# EAGLE design Mult-tl084 (EAGLE 9.2.0)
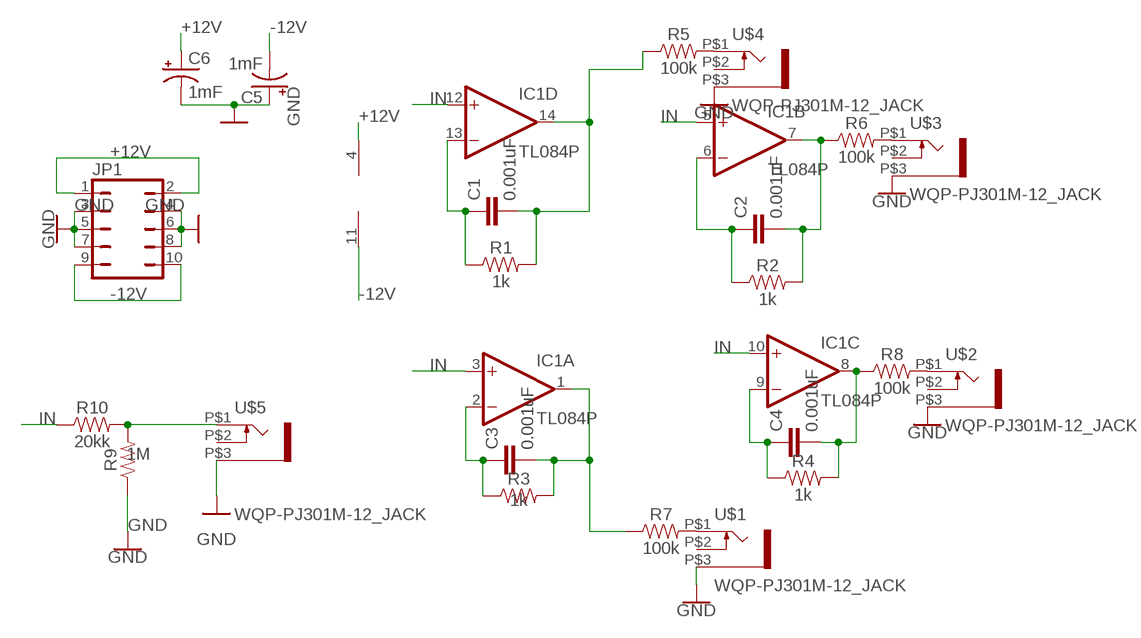
[diagram p0: schematic, sheet 1]

## Parts
C1  0.001uF  0.1UF-KIT-EZ-50V-20%  [CAP-PTH-SMALL-KIT]
C2  0.001uF  0.1UF-KIT-EZ-50V-20%  [CAP-PTH-SMALL-KIT]
C3  0.001uF  0.1UF-KIT-EZ-50V-20%  [CAP-PTH-SMALL-KIT]
C4  0.001uF  0.1UF-KIT-EZ-50V-20%  [CAP-PTH-SMALL-KIT]
C5  1mF  1000UF-RADIAL-5MM-25V-20%  [CPOL-RADIAL-5MM-10MM]
C6  1mF  1000UF-RADIAL-5MM-25V-20%  [CPOL-RADIAL-5MM-10MM]
IC1  TL084P  [DIL14]
JP1  JP5Q  [JP5Q]
R1  1k  1KOHM-HORIZ-1/4W-5%  [AXIAL-0.3]
R2  1k  1KOHM-HORIZ-1/4W-5%  [AXIAL-0.3]
R3  1k  1KOHM-HORIZ-1/4W-5%  [AXIAL-0.3]
R4  1k  1KOHM-HORIZ-1/4W-5%  [AXIAL-0.3]
R5  100k  1KOHM-HORIZ-1/4W-5%  [AXIAL-0.3]
R6  100k  1KOHM-HORIZ-1/4W-5%  [AXIAL-0.3]
R7  100k  1KOHM-HORIZ-1/4W-5%  [AXIAL-0.3]
R8  100k  1KOHM-HORIZ-1/4W-5%  [AXIAL-0.3]
R9  1M  1KOHM-HORIZ-1/4W-5%  [AXIAL-0.3]
R10  20kk  1KOHM-HORIZ-1/4W-5%  [AXIAL-0.3]
U$1  WQP-PJ301M-12_JACK  [WQP-PJ301M-12_JACK]
U$2  WQP-PJ301M-12_JACK  [WQP-PJ301M-12_JACK]
U$3  WQP-PJ301M-12_JACK  [WQP-PJ301M-12_JACK]
U$4  WQP-PJ301M-12_JACK  [WQP-PJ301M-12_JACK]
U$5  WQP-PJ301M-12_JACK  [WQP-PJ301M-12_JACK]

## Nets
+12V: C6.+ IC1.4(P:V+) JP1.1 JP1.2
-12V: C5.- IC1.11(P:V-) JP1.9 JP1.10
GND: C5.+ C6.- JP1.3 JP1.4 JP1.5 JP1.6 JP1.7 JP1.8 R9.P$1 U$1.P$3 U$2.P$3 U$3.P$3 U$4.P$3 U$5.P$3
IN: IC1.3(A:+IN) IC1.5(B:+IN) IC1.10(C:+IN) IC1.12(D:+IN) R10.P$1
N$1: C1.1 IC1.13(D:-IN) R1.P$1
N$2: C1.2 IC1.14(D:OUT) R1.P$2 R5.P$1
N$3: C2.1 IC1.6(B:-IN) R2.P$1
N$4: C2.2 IC1.7(B:OUT) R2.P$2 R6.P$1
N$5: C3.1 IC1.2(A:-IN) R3.P$1
N$6: C3.2 IC1.1(A:OUT) R3.P$2 R7.P$1
N$7: C4.1 IC1.9(C:-IN) R4.P$1
N$8: R8.P$2 U$2.P$1
N$9: C4.2 IC1.8(C:OUT) R4.P$2 R8.P$1
N$10: R6.P$2 U$3.P$1
N$11: R5.P$2 U$4.P$1
N$12: R7.P$2 U$1.P$1
N$13: R9.P$2 R10.P$2 U$5.P$1
Unconnected: U$1.P$2 U$2.P$2 U$3.P$2 U$4.P$2 U$5.P$2

## Library data of the parts
C1-C4 = SparkFun-Capacitors:0.1UF: 0.1µF ceramic capacitors A capacitor is a passive two-terminal electrical component used to store electrical energy temporarily in an electric field.; PROD_ID: CAP-08370; VALUE: 0.1uF
C5 C6 = SparkFun-Capacitors:1000UF: 1,000µF/1mF ceramic capacitors A capacitor is a passive two-terminal electrical component used to store electrical energy temporarily in an electric field. CAP-08070; PROD_ID: CAP-09538
IC1 = linear:TL084: OP AMP
JP1 = jumper:JP5Q: JUMPER
R1-R4 = SparkFun-Resistors:1KOHM: 1kΩ resistor A resistor is a passive two-terminal electrical component that implements electrical resistance as a circuit element. Resistors act to reduce current flow, and, at the same time, act to lower voltage levels within circuits. - Wikipedia; PROD_ID: RES-08380
R5-R10 = SparkFun-Resistors:1KOHM: 1kΩ resistor A resistor is a passive two-terminal electrical component that implements electrical resistance as a circuit element. Resistors act to reduce current flow, and, at the same time, act to lower voltage levels within circuits. - Wikipedia; PROD_ID: RES-08380; VALUE: 1k
U$1-U$5 = thonkiconn:WQP-PJ301M-12_JACK

## Board
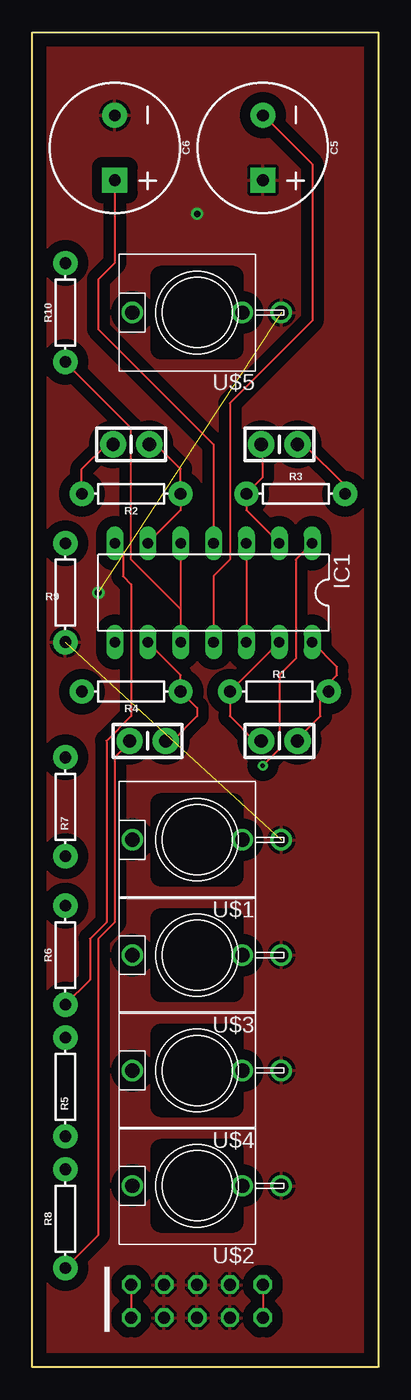
[diagram p1: board, top side]
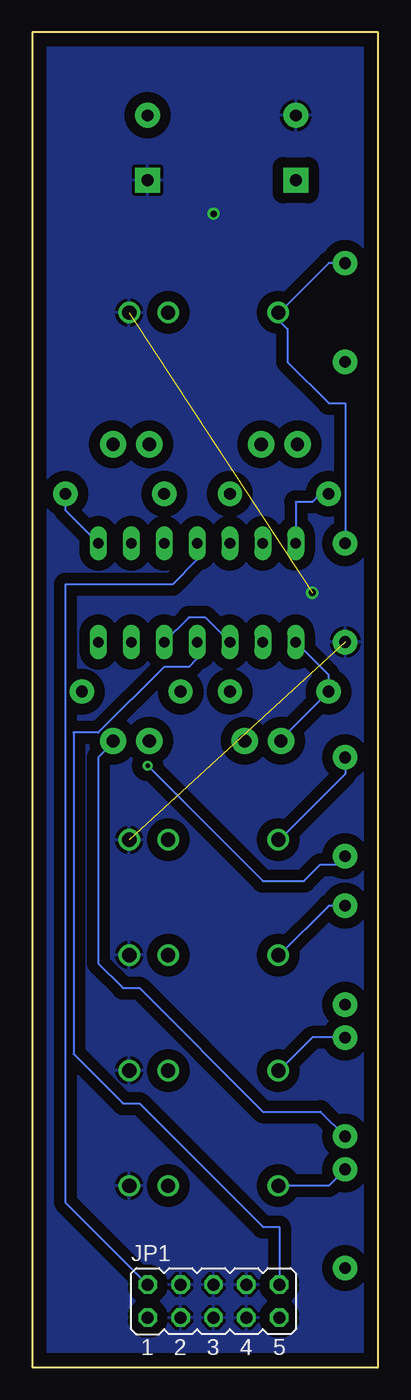
[diagram p2: board, bottom side, seen from below]

Size 26.67 x 102.87 mm. Coordinates in mm from the lower left corner, seen from the top.
Outline: 0,0 0,102.87 26.67,102.87 26.67,0 0,0
Copper layers (1*16): Top 0.035mm / dielectric 1.5mm / Bottom 0.035mm
Design rules "default": minimum track width 6mil, minimum drill 0.35mm, track to track 6mil, track to pad 6mil, pad to pad 6mil, via to via 6mil, smd to smd 6mil, copper to edge 40mil, drill to drill 6mil, minimum pad ring 10mil, minimum via ring 8mil, stop-mask expansion 4mil, vias tented up to drill 0mil, thermal gap 10mil

### Footprints (pad centres in the part's own frame; a part is rotated, then mirrored left to right if it is on the bottom)
CAP-PTH-SMALL-KIT = drill 1.016 pad 2.032: 1 -1.397,0; 2 1.397,0
CPOL-RADIAL-5MM-10MM = drill 0.9 pad 1.93 square: + 2.5,0 | drill 0.9 pad 1.93: - -2.5,0
DIL14 = drill 0.813 long: 1 -7.62,-3.81; 2 -5.08,-3.81; 3 -2.54,-3.81; 4 0,-3.81; 5 2.54,-3.81; 6 5.08,-3.81; 7 7.62,-3.81; 8 7.62,3.81; 9 5.08,3.81; 10 2.54,3.81; 11 0,3.81; 12 -2.54,3.81; 13 -5.08,3.81; 14 -7.62,3.81
JP5Q = drill 0.914 octagon: 1 -5.08,-1.27; 2 -5.08,1.27; 3 -2.54,-1.27; 4 -2.54,1.27; 5 0,-1.27; 6 0,1.27; 7 2.54,-1.27; 8 2.54,1.27; 9 5.08,-1.27; 10 5.08,1.27
AXIAL-0.3 = drill 0.9 pad 1.88: P$1 -3.81,0; P$2 3.81,0
WQP-PJ301M-12_JACK = drill 1.1: P$1 0,5; P$2 0,-3.5; P$3 0,-6.5

### Placement (x,y rotation side)
C1  19.05,48.26 0 top
C2  7.62,71.12 180 top
C3  19.05,71.12 0 top
C4  8.89,48.26 180 top
C5  17.78,93.98 270 top
C6  6.35,93.98 270 top
IC1  13.97,59.69 180 top
JP1  12.7,5.08 0 bottom
R1  19.05,52.07 0 top
R2  7.62,67.31 180 top
R3  20.32,67.31 0 top
R4  7.62,52.07 180 top
R5  2.54,21.59 90 top
R6  2.54,31.75 90 top
R7  2.54,43.18 90 top
R8  2.54,11.43 90 top
R9  2.54,59.69 90 top
R10  2.54,81.28 90 top
U$1  12.7,40.64 90 top
U$2  12.7,13.97 90 top
U$3  12.7,31.75 90 top
U$4  12.7,22.86 90 top
U$5  12.7,81.28 90 top

### Tracks (layer width: path | path; a pad name or v marks a point on that pad's centre or on a via)
+12V
  Top 0.152: JP1.2 JP1.1 | IC1.4 13.97,71.12 5.08,80.01 5.08,83.82 6.35,85.09 C6.+
  Bottom 0.152: JP1.2 24.13,12.7 24.13,60.33 15.88,60.33 13.97,62.23 IC1.4
-12V
  Top 0.152: JP1.10 JP1.9 | IC1.11 13.97,60.96 15.24,62.23 15.24,74.3 21.59,80.64 21.59,92.71 17.78,96.52 C5.-
  Bottom 0.152: JP1.10 7.62,10.79 8.89,10.79 18.41,20.32 19.68,20.32 23.5,24.13 23.5,48.9 21.59,48.9 16.51,53.98 14.61,53.98 13.97,54.61 IC1.11
GND  (via drill 0.5, 0.55)  (2 unrouted)
  other vias: 12.7,88.9 5.08,59.69
  pour Bottom (isolate 0.813): 0,0 0,102.87 26.67,102.87 26.67,0
  pour Top (isolate 0.813): 0,0 0,102.87 26.67,102.87 26.67,0
IN
  Top 0.152: IC1.3 IC1.12 | IC1.5 11.43,58.42 | 11.43,58.42 IC1.10 | R10.P$1 7.62,72.39 7.62,62.23 11.43,58.42
  Bottom 0.152: IC1.12 14.61,57.78 13.34,57.78 IC1.10
N$1
  Top 0.152: IC1.13 R1.P$1 15.24,50.16 17.14,48.26 C1.1
N$2
  Top 0.152: IC1.14 23.5,53.98 23.5,53.34 22.86,52.7 R1.P$2 22.23,51.44 22.23,50.16 20.95,48.9 20.95,48.26 C1.2
  Bottom 0.152: R5.P$1 4.45,19.68 8.89,19.68 18.41,29.21 19.68,29.21 21.59,31.11 21.59,46.99 20.32,48.26 C1.2
N$3
  Top 0.152: IC1.6 11.43,66.04 R2.P$1 11.43,69.22 9.53,71.12 C2.1
N$4
  Top 0.152: R6.P$1 4.45,29.84 4.45,33.02 5.71,34.29 5.71,48.26 7.62,50.16 7.62,60.33 6.99,60.96 6.99,62.87 IC1.7 | R2.P$2 3.81,69.22 5.71,71.12 C2.2
  Bottom 0.152: IC1.7 6.35,66.67 5.08,66.67 4.45,67.31 R2.P$2
N$5
  Top 0.152: IC1.2 16.51,66.04 R3.P$1 17.78,68.58 17.78,71.12 C3.1
N$6  (via drill 0.35)
  Top 0.152: v17.78,46.35 19.05,47.62 19.05,53.34 20.32,54.61 20.32,62.23 IC1.1 | R3.P$2 24.13,67.94 20.95,71.12 C3.2
  Bottom 0.152: IC1.1 24.13,66.04 R3.P$2 | R7.P$1 3.17,38.73 4.45,38.73 5.71,37.47 8.89,37.47 v17.78,46.35
N$7
  Top 0.152: IC1.9 11.43,53.34 R4.P$1 12.7,50.8 12.7,50.16 10.79,48.26 C4.1
N$8
  Bottom 0.152: U$2.P$1 3.81,13.97 R8.P$2
N$9
  Top 0.152: R8.P$1 5.08,10.16 5.08,33.02 6.35,34.29 6.35,46.99 6.99,47.62 6.99,48.26 C4.2
  Bottom 0.152: IC1.8 3.81,53.34 R4.P$2 7.62,48.26 C4.2
N$10
  Bottom 0.152: R6.P$2 3.81,35.56 7.62,31.75 U$3.P$1
N$11
  Bottom 0.152: R5.P$2 5.08,25.4 7.62,22.86 U$4.P$1
N$12
  Bottom 0.152: R7.P$2 2.54,45.72 7.62,40.64 U$1.P$1
N$13
  Bottom 0.152: R10.P$2 3.81,85.09 7.62,81.28 U$5.P$1 8.26,81.28 6.99,80.01 6.99,77.47 3.81,74.3 2.54,74.3 R9.P$2

### Text on the board
tNames: |